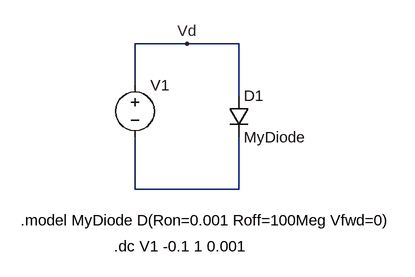
[diagram p0: schematic diodi.asc]
diodi.asc, the LTspice schematic file:
Version 4.1
SHEET 1 3448 2144
WIRE -432 256 -512 256
WIRE -352 256 -432 256
WIRE -512 320 -512 256
WIRE -352 336 -352 256
WIRE -512 480 -512 400
WIRE -352 480 -352 400
WIRE -352 480 -512 480
FLAG -432 256 Vd
SYMBOL voltage -512 304 R0
WINDOW 123 0 0 Left 0
WINDOW 39 0 0 Left 0
WINDOW 3 -65 57 Left 2
SYMATTR Value ""
SYMATTR InstName V1
SYMBOL diode -368 336 R0
SYMATTR InstName D1
SYMATTR Value MyDiode
TEXT -544 568 Left 2 !.dc V1 -0.1 1 0.001
TEXT -688 528 Left 2 !.model MyDiode D(Ron=0.001 Roff=100Meg Vfwd=0)

The netlist it stands for:
* diodi.asc
V1 Vd N001
D1 Vd N001 MyDiode
.model D D
.lib standard.dio
.dc V1 -0.1 1 0.001
.model MyDiode D(Ron=0.001 Roff=100Meg Vfwd=0)
.backanno
.end